# EAGLE schematic stm32_usbserial (EAGLE 7.1.0)

## Sheet 1 of 3
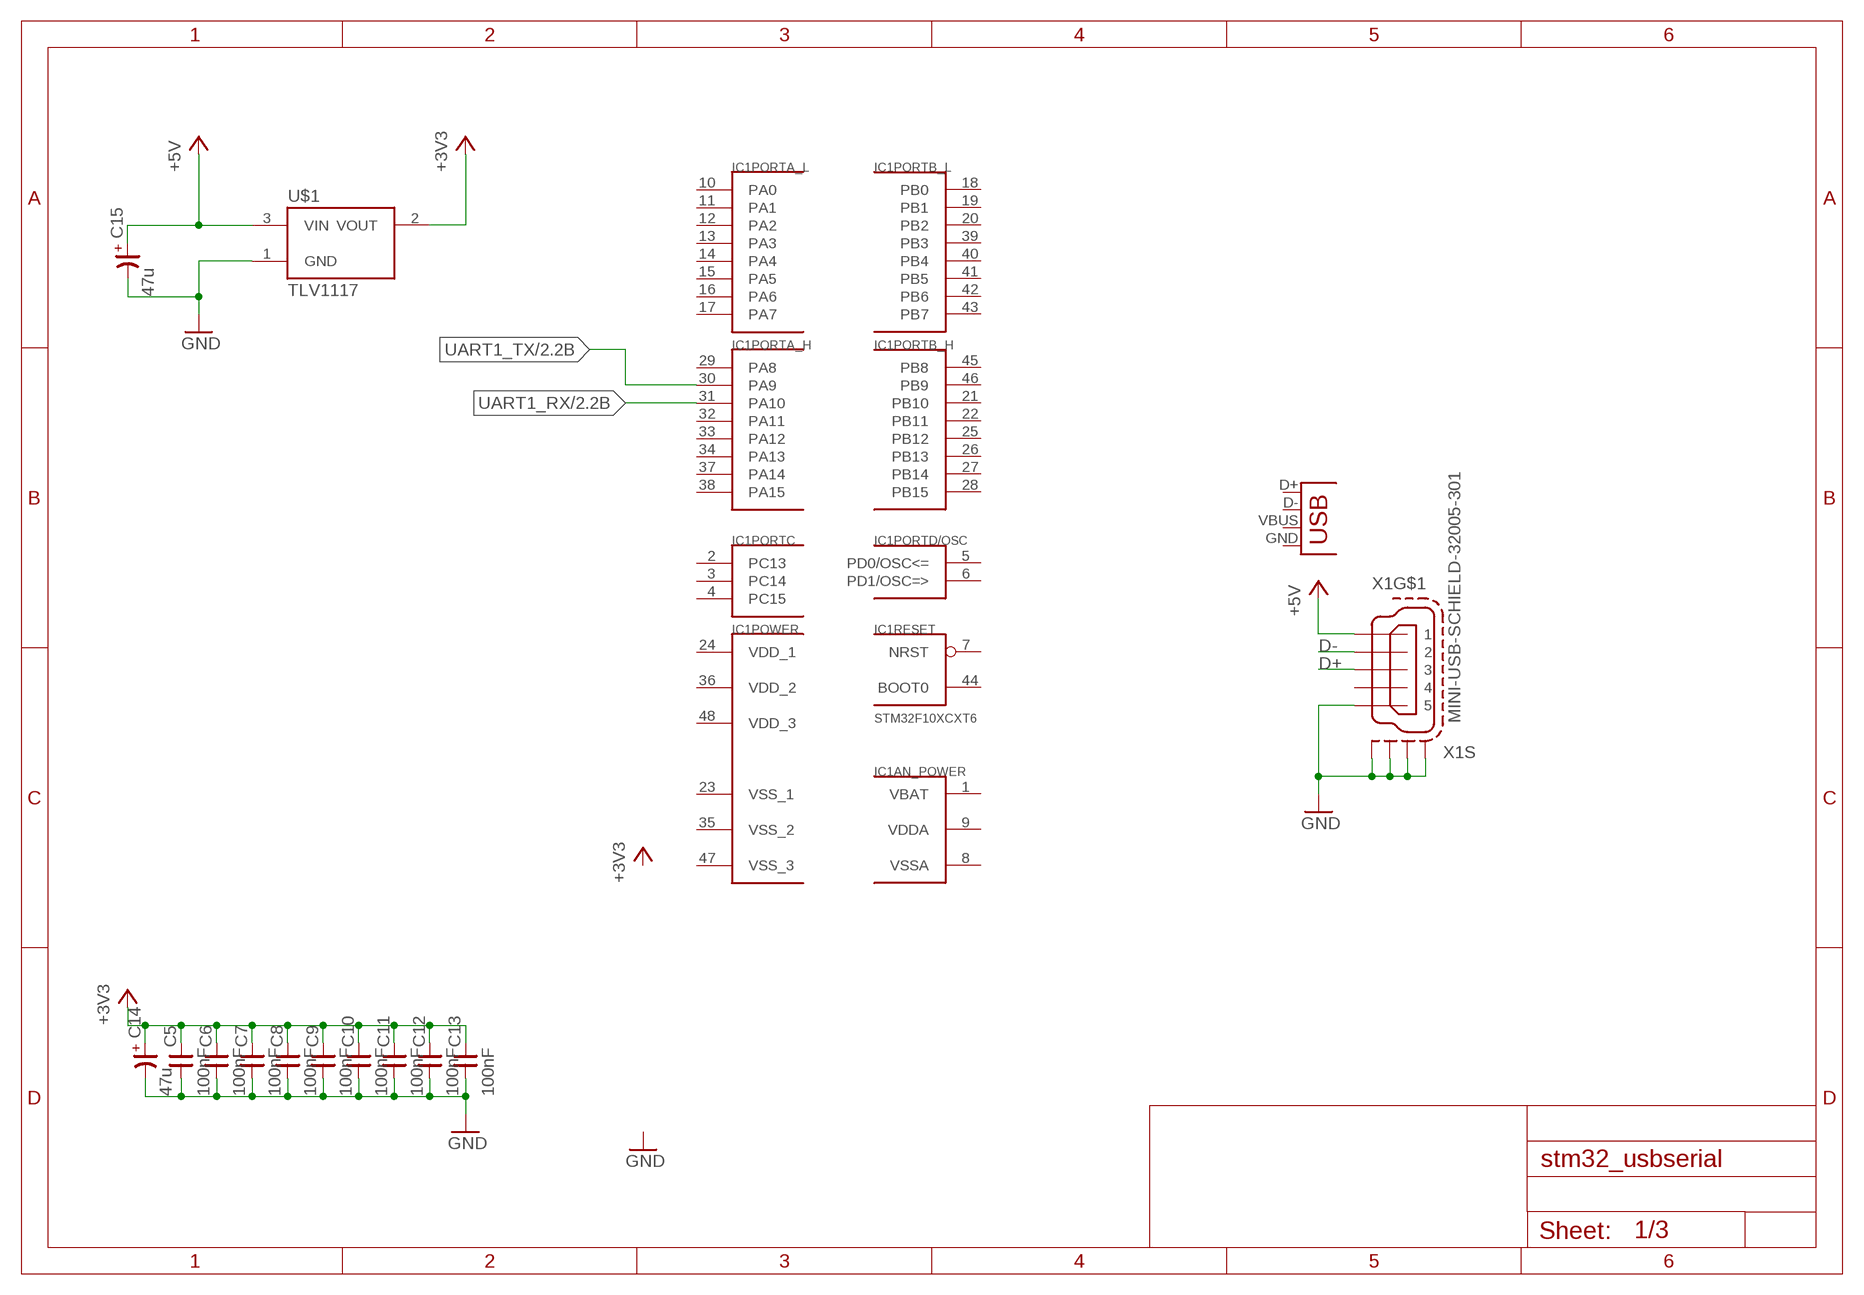
[diagram p0: schematic, sheet 1]

### Parts
C5  100nF  CNP-0805  [0805]
C6  100nF  CNP-0805  [0805]
C7  100nF  CNP-0805  [0805]
C8  100nF  CNP-0805  [0805]
C9  100nF  CNP-0805  [0805]
C10  100nF  CNP-0805  [0805]
C11  100nF  CNP-0805  [0805]
C12  100nF  CNP-0805  [0805]
C13  100nF  CNP-0805  [0805]
C14  47u  CP-153CLV-1012  [153CLV-1012]
C15  47u  CP-153CLV-1012  [153CLV-1012]
IC1  STM32F10XCXT6  [TQFP48]
U$1  TLV1117  [SOT223]
X1  MINI-USB-SCHIELD-32005-301  [32005-301]
X2  USB-MB-S  [USB-MB-S]

### Nets
+3V3: C5.2 C6.2 C7.2 C8.2 C9.2 C10.2 C11.2 C12.2 C13.2 C14.+ U$1.2(VOUT) U$1.4(VOUT2) ; also sheet 2
+5V: C15.+ U$1.3(VIN) X1.1
D+: X1.3
D-: X1.2
GND: C5.1 C6.1 C7.1 C8.1 C9.1 C10.1 C11.1 C12.1 C13.1 C14.- C15.- U$1.1(GND) X1.5 X1.M1(S:S1) X1.M2(S:S2) X1.M3(S:S3) X1.M4(S:S4) ; also sheet 2
UART1_RX: IC1.31(PORTA_H:PA10) ; also sheet 2
UART1_TX: IC1.30(PORTA_H:PA9) ; also sheet 2
Unconnected: IC1.2(PORTC:PC13) IC1.3(PORTC:PC14) IC1.4(PORTC:PC15) IC1.5(PORTD/OSC:PD0/OSC<=) IC1.6(PORTD/OSC:PD1/OSC=>) IC1.7(RESET:NRST) IC1.10(PORTA_L:PA0) IC1.11(PORTA_L:PA1) IC1.12(PORTA_L:PA2) IC1.13(PORTA_L:PA3) IC1.14(PORTA_L:PA4) IC1.15(PORTA_L:PA5) IC1.16(PORTA_L:PA6) IC1.17(PORTA_L:PA7) IC1.18(PORTB_L:PB0) IC1.19(PORTB_L:PB1) IC1.20(PORTB_L:PB2) IC1.21(PORTB_H:PB10) IC1.22(PORTB_H:PB11) IC1.25(PORTB_H:PB12) IC1.26(PORTB_H:PB13) IC1.27(PORTB_H:PB14) IC1.28(PORTB_H:PB15) IC1.29(PORTA_H:PA8) IC1.32(PORTA_H:PA11) IC1.33(PORTA_H:PA12) IC1.34(PORTA_H:PA13) IC1.37(PORTA_H:PA14) IC1.38(PORTA_H:PA15) IC1.39(PORTB_L:PB3) IC1.40(PORTB_L:PB4) IC1.41(PORTB_L:PB5) IC1.42(PORTB_L:PB6) IC1.43(PORTB_L:PB7) IC1.44(RESET:BOOT0) IC1.45(PORTB_H:PB8) IC1.46(PORTB_H:PB9) X1.4 X2.D+ X2.D- X2.GND X2.VBUS

## Sheet 2 of 3: UART
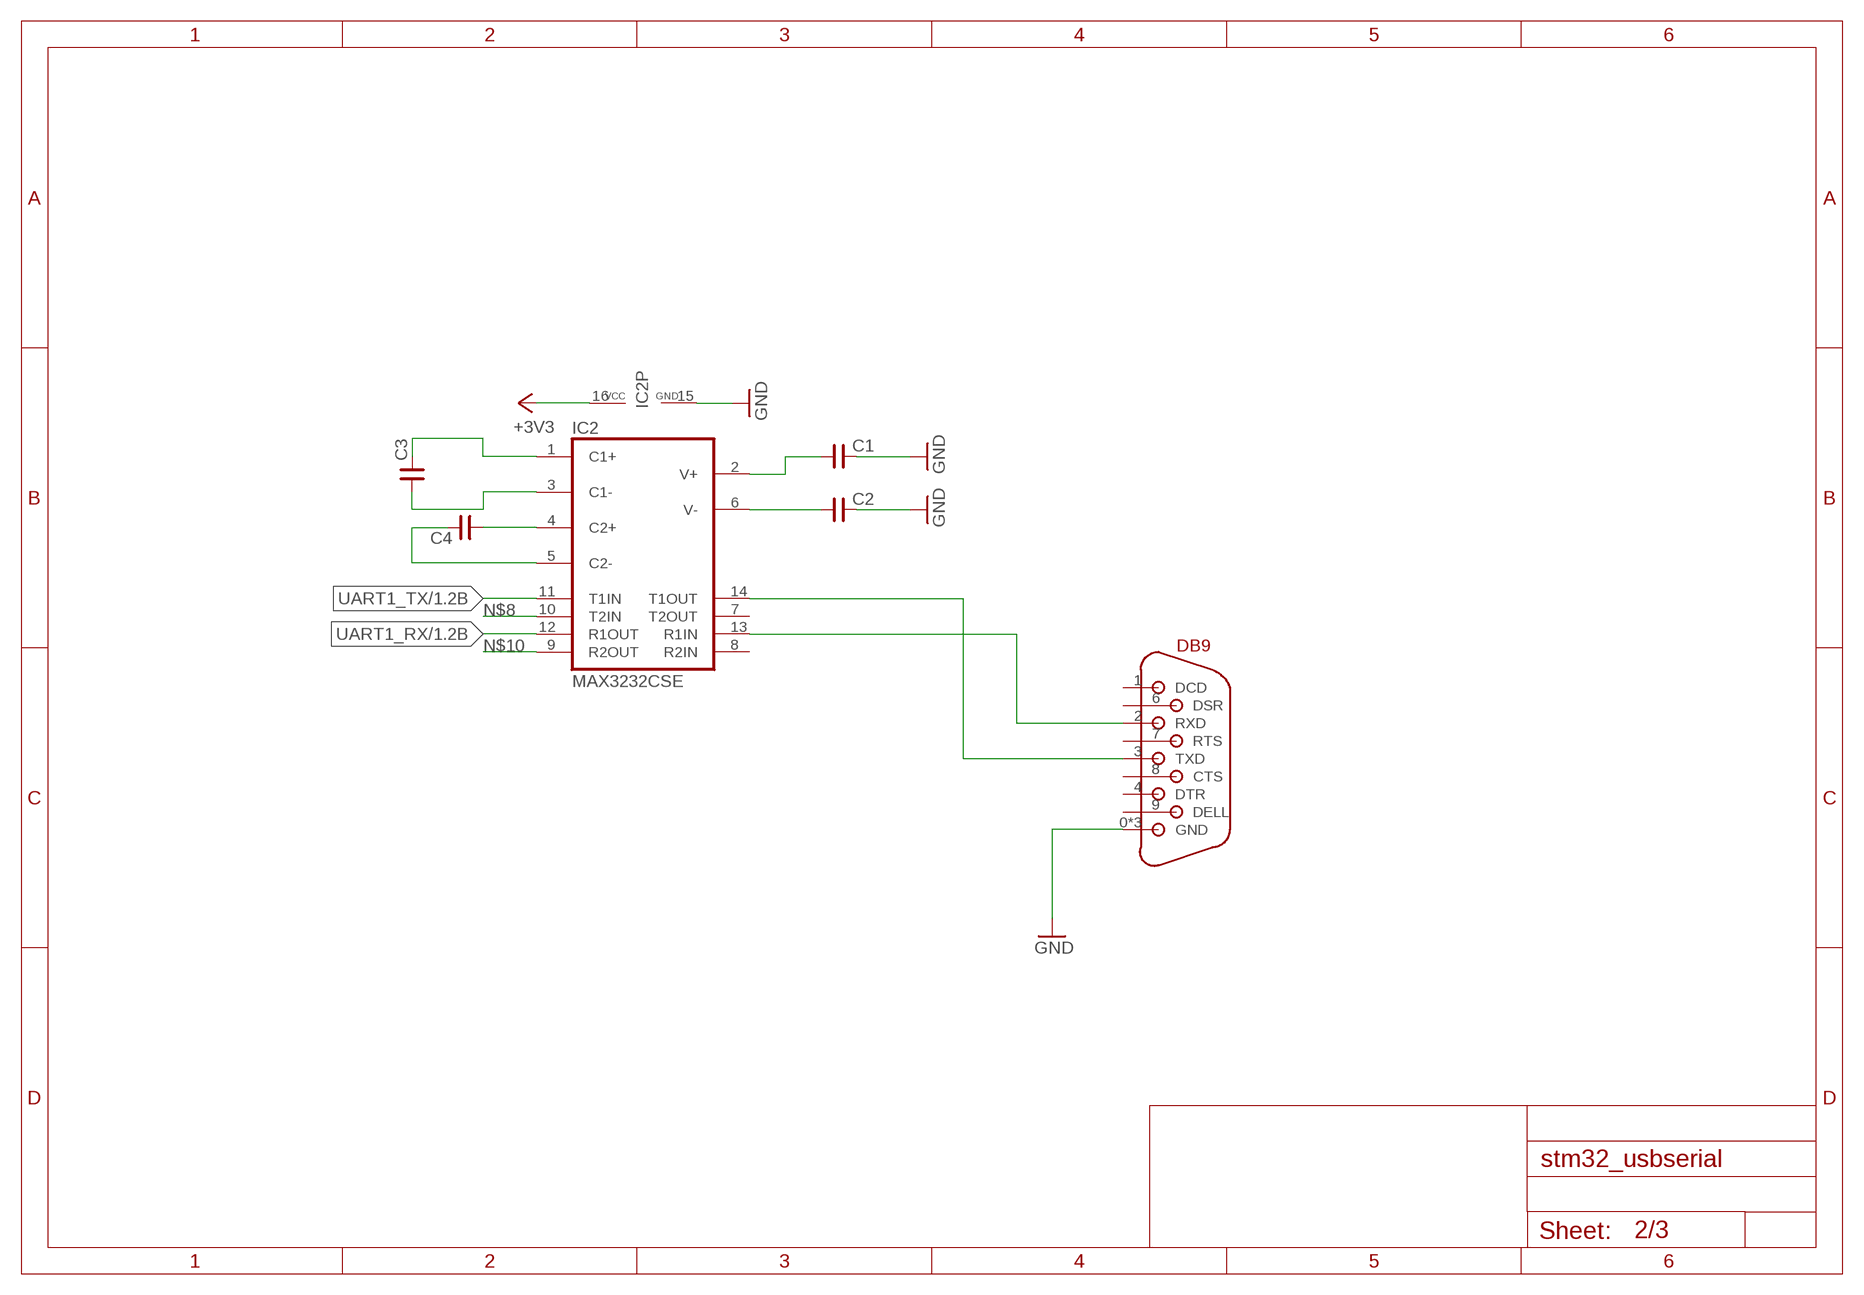
[diagram p1: schematic, sheet 2]

### Parts
C1  CNP-0805  [0805]
C2  CNP-0805  [0805]
C3  CNP-0805  [0805]
C4  CNP-0805  [0805]
IC2  MAX3232CSE  [SO16]
U$2  DB9-FMALE'FMALE'  [DB9-FMALE]

### Nets
+3V3: IC2.16(VCC) ; also sheet 1
GND: C1.2 C2.2 IC2.15(GND) U$2.0(GND) U$2.5(GND) U$2.10(GND) ; also sheet 1
N$1: C3.2 IC2.1(C1+)
N$2: C3.1 IC2.3(C1-)
N$3: C4.1 IC2.4(C2+)
N$4: C4.2 IC2.5(C2-)
N$5: C1.1 IC2.2(V+)
N$6: C2.1 IC2.6(V-)
N$7: IC2.13(R1IN) U$2.2(RXD)
N$8: IC2.10(T2IN)
N$9: IC2.14(T1OUT) U$2.3(TXD)
N$10: IC2.9(R2OUT)
UART1_RX: IC2.12(R1OUT) ; also sheet 1
UART1_TX: IC2.11(T1IN) ; also sheet 1
Unconnected: IC2.7(T2OUT) IC2.8(R2IN) U$2.1(DCD) U$2.4(DTR) U$2.6(DSR) U$2.7(RTS) U$2.8(CTS) U$2.9(DELL)

## Sheet 3 of 3

## Power pins joined to a net without a drawn wire
VBAT: IC1.1(AN_POWER:VBAT)
VDD_1: IC1.24(POWER:VDD_1)
VDD_2: IC1.36(POWER:VDD_2)
VDD_3: IC1.48(POWER:VDD_3)
VDDA: IC1.9(AN_POWER:VDDA)
VSS_1: IC1.23(POWER:VSS_1)
VSS_2: IC1.35(POWER:VSS_2)
VSS_3: IC1.47(POWER:VSS_3)
VSSA: IC1.8(AN_POWER:VSSA)

## Library data of the parts
C1-C13 = cap-master:CNP-: NON-POLARIZED CAP
C14 C15 = cap-master:CP-: POLARIZED CAP
IC1 = stm32:STM32F10XCXT6: ST STM32F101/103 48pin LQFP
IC2 = stm32_usbserial:MAX3232*: True RS-232 Transceivers 3.0V to 5.5V, Low-Power up to 1Mbps, Using Four 0.1µF External Capacitors Source: http://pdfserv.maxim-ic.com/en/ds/MAX3222-MAX3241.pdf; MPN: MAX3232CSE; OC_FARNELL: 9725490; OC_NEWARK: 90C2890
U$1 = stm32_usbserial:TLV1117
U$2 = stm32_usbserial:DB9-*
X1 = con-cypressindustries:MINI-USB-SCHIELD-: MINI USB-B Conector Source: www.cypressindustries.com; OC_FARNELL: unknown; OC_NEWARK: unknown
X2 = stm32_usbserial:USB: USB Connectors